# Altium schematic sheet Switch.SchDoc
size A4
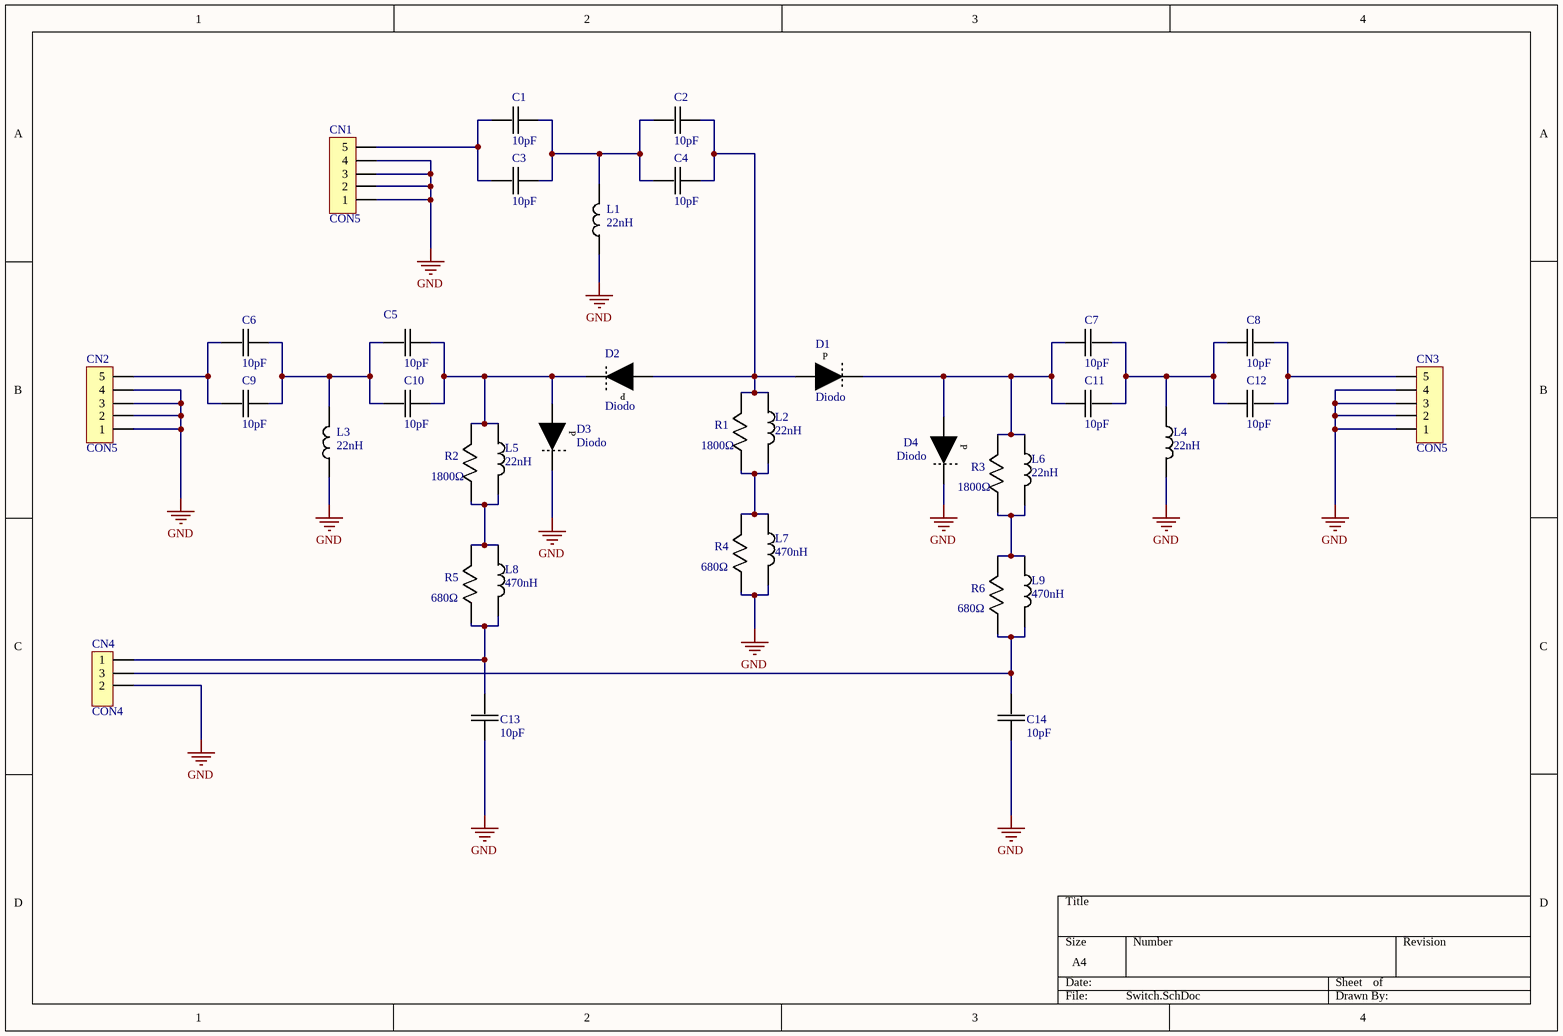
[diagram p0: Switch.SchDoc]

## Parts
C1  10pF  [C_0603]
C2  10pF  [C_0603]
C3  10pF  [C_0603]
C4  10pF  [C_0603]
C5  10pF  [C_0603]
C6  10pF  [C_0603]
C7  10pF  [C_0603]
C8  10pF  [C_0603]
C9  10pF  [C_0603]
C10  10pF  [C_0603]
C11  10pF  [C_0603]
C12  10pF  [C_0603]
C13  10pF  [C_0603]
C14  10pF  [C_0603]
CN1  CON5  [SMA]
CN2  CON5  [SMA]
CN3  CON5  [SMA]
CN4  CON4  [CON3]
D1  Diodo  [SC79]
D2  Diodo  [SC79]
D3  Diodo  [SC79]
D4  Diodo  [SC79]
L1  22nH  [L_0603]
L2  22nH  [L_0603]
L3  22nH  [L_0603]
L4  22nH  [L_0603]
L5  22nH  [L_0603]
L6  22nH  [L_0603]
L7  470nH  [L_0603]
L8  470nH  [L_0603]
L9  470nH  [L_0603]
R1  1800Ω  [R_0603]
R2  1800Ω  [R_0603]
R3  1800Ω  [R_0603]
R4  680Ω  [R_0603]
R5  680Ω  [R_0603]
R6  680Ω  [R_0603]

## Nets
GND: C13.2 C14.2 CN1.1 CN1.2 CN1.3 CN1.4 CN2.1 CN2.2 CN2.3 CN2.4 CN3.1 CN3.2 CN3.3 CN3.4 CN4.2 D3.K D4.K L1.2 L3.2 L4.2 L7.1 R4.1
NetC1_1: C1.1 C3.1 CN1.5
NetC1_2: C1.2 C2.1 C3.2 C4.1 L1.1
NetC2_2: C2.2 C4.2 D1.A D2.A L2.2 R1.2
NetC5_1: C5.1 C6.2 C9.2 C10.1 L3.1
NetC5_2: C5.2 C10.2 D2.K D3.A L5.2 R2.2
NetC6_1: C6.1 C9.1 CN2.5
NetC7_1: C7.1 C8.2 C11.1 C12.2 L4.1
NetC7_2: C7.2 C11.2 D1.K D4.A L6.2 R3.2
NetC8_1: C8.1 C12.1 CN3.5
NetC13_1: C13.1 CN4.1 L8.1 R5.1
NetC14_1: C14.1 CN4.3 L9.1 R6.1
NetL2_1: L2.1 L7.2 R1.1 R4.2
NetL5_1: L5.1 L8.2 R2.1 R5.2
NetL6_1: L6.1 L9.2 R3.1 R6.2

## Notes on the sheet
- (in symbol Diodo) P

## Library data of the parts
C1-C14 = C_0805: Capacitor
CN1-CN3 = CON5: Conector SMA
CN4 = CON4: Conector SMA
D1-D4 = Diodo: Diodo Pin
L1-L9 = L_0805: Inductor
R1-R6 = R_0805: Resistor